# Altium schematic sheet cm_pwr.SchDoc
size 209 x 297 mm; SheetNumber: 3; SheetTotal: 12
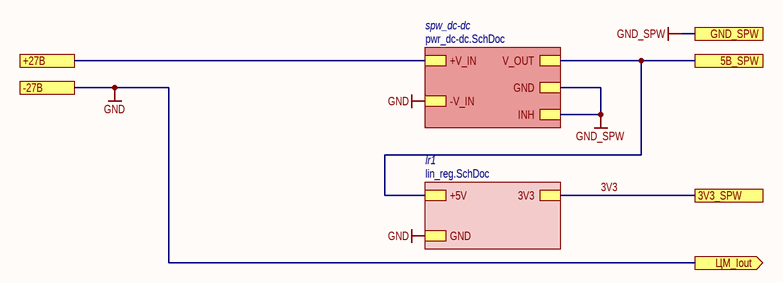
[diagram p0: cm_pwr.SchDoc]

## Sub-sheets
lr1 = lin_reg.SchDoc: 3V3, GND, +5V
spw_dc-dc = pwr_dc-dc.SchDoc: GND, INH, V_OUT, -V_IN, +V_IN

## Ports
3V3_SPW, 5В_SPW, +27В, -27В, GND_SPW, ЦМ_Iout (out)

## Nets
GND: port -27В, port ЦМ_Iout, sheet spw_dc-dc/-V_IN, sheet lr1/GND
GND_SPW: port GND_SPW, sheet spw_dc-dc/GND, sheet spw_dc-dc/INH
3V3: port 3V3_SPW, sheet lr1/3V3
5В_SPW: port 5В_SPW, sheet spw_dc-dc/V_OUT, sheet lr1/+5V
+27В: port +27В, sheet spw_dc-dc/+V_IN

## Notes on the sheet
- Подп. и дата
- Инв. № дубл.
- Взам. инв. №
- Инв. № подл.
- Изм.
- Лист
- № докум.
- Подп.
- Дата
- Форма 2а ГОСТ 2.104-2006
- Копировал
- Формат А4